# EAGLE design BreakBeamEmitter (EAGLE 6.5.0)
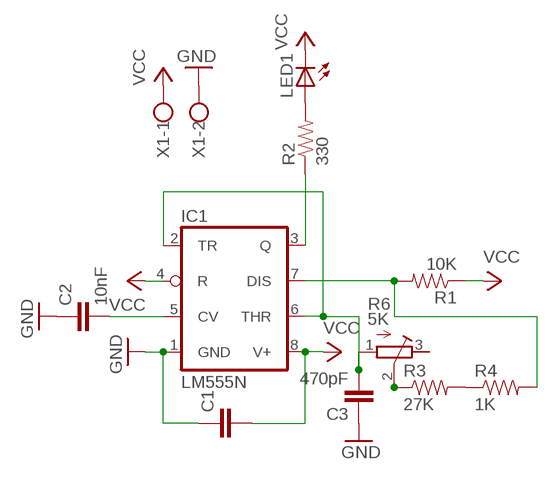
[diagram p0: schematic, sheet 1]

## Parts
C1  CAPPTH1  [CAP-PTH-5MM]
C2  10nF  CAPPTH1  [CAP-PTH-5MM]
C3  470pF  CAPPTH1  [CAP-PTH-5MM]
IC1  LM555N  [DIL08-ROUND]
LED1  LED5MM  [LED5MM]
R1  10K  RESISTORAXIAL-0.3  [AXIAL-0.3]
R2  330  RESISTORAXIAL-0.3  [AXIAL-0.3]
R3  27K  RESISTORAXIAL-0.3  [AXIAL-0.3]
R4  1K  RESISTORAXIAL-0.3  [AXIAL-0.3]
R6  5K  R-TRIMM64Y  [RTRIM64Y]
X1  W237-102  [W237-102]

## Nets
GND: C1.1 C2.1 C3.1 IC1.1(GND) X1.2
N$2: C3.2 IC1.2(TR) IC1.6(THR) R6.1(E)
N$3: R3.P$2 R4.P$1
N$4: R3.P$1 R6.2(S)
N$5: C2.2 IC1.5(CV)
N$6: LED1.A R2.P$2
N$7: IC1.3(Q) R2.P$1
N$8: IC1.7(DIS) R1.P$2 R4.P$2
VCC: C1.2 IC1.4(R) IC1.8(V+) LED1.K(C) R1.P$1 X1.1
Unconnected: R6.3(A)

## Library data of the parts
C1-C3 = SparkFun-Capacitors:CAP: Capacitor Standard 0603 ceramic capacitor, and 0.1" leaded capacitor.
IC1 = adafruit:*555: TIMER Changed DIP package to have round (not oval) pin pads http://www.ladyada.net/library/pcb/eaglelibrary.html
LED1 = adafruit:LED: LED OSRAM: - CHIPLED LG R971, LG N971, LY N971, LG Q971, LY Q971, LO R971, LY R971 LH N974, LH R974 LS Q976, LO Q976, LY Q976 LO Q996 - Hyper CHIPLED LW Q18S LB Q993, LB Q99A, LB R99A - SideLED LS A670, LO A670, LY A670, LG A670, LP A670 LB A673, LV A673, LT A673, LW A673 LH A674 LY A675 LS A676, LA A676, LO A676, LY A676, LW A676 LS A679, LY A679, LG A679 - Hyper Micro SIDELED® LS Y876, LA Y876, LO Y876, LY Y876 LT Y87S - SmartLED LW L88C, LW L88S LB L89C, LB L89S, LG L890 LS L89K, LO L89K, LY L89K LS L896, LA L896, LO L896, LY L896 - TOPLED LS T670, LO T670, LY T670, LG T670, LP T670 LSG T670, LSP T670, LSY T670, LOP T670, LYG T670 LG T671, LOG T671, LSG T671 LB T673, LV T673, LT T673, LW T673 LH T674 LS T676, LA T676, LO T676, LY T676, LB T676, LH T676, LSB T676, LW T676 LB T67C, LV T67C, LT T67C, LS T67K, LO T67K, LY T67K, LW E67C LS E67B, LA E67B, LO E67B, LY E67B, LB E67C, LV E67C, LT E67C LW T67C LS T679, LY T679, LG T679 LS T770, LO T770, LY T770, LG T770, LP T770 LB T773, LV T773, LT T773, LW T773 LH T774 LS E675, LA E675, LY E675, LS T675 LS T776, LA T776, LO T776, LY T776, LB T776 LHGB T686 LT T68C, LB T68C - Hyper Mini TOPLED® LB M676 - Mini TOPLED Santana® LG M470 LS M47K, LO M47K, LY M47K Source: http://www.osram.convergy.de/
R1-R4 = SparkFun-Resistors:RESISTOR: Resistor Basic schematic elements and footprints for 0603, 1206, and PTH resistors.
R6 = resistor:R-TRIMM: Trimm resistor
X1 = con-wago-500:W237-102: WAGO SCREW CLAMP; MPN: 237-102; OC_FARNELL: unknown; OC_NEWARK: 70K9898

## Board
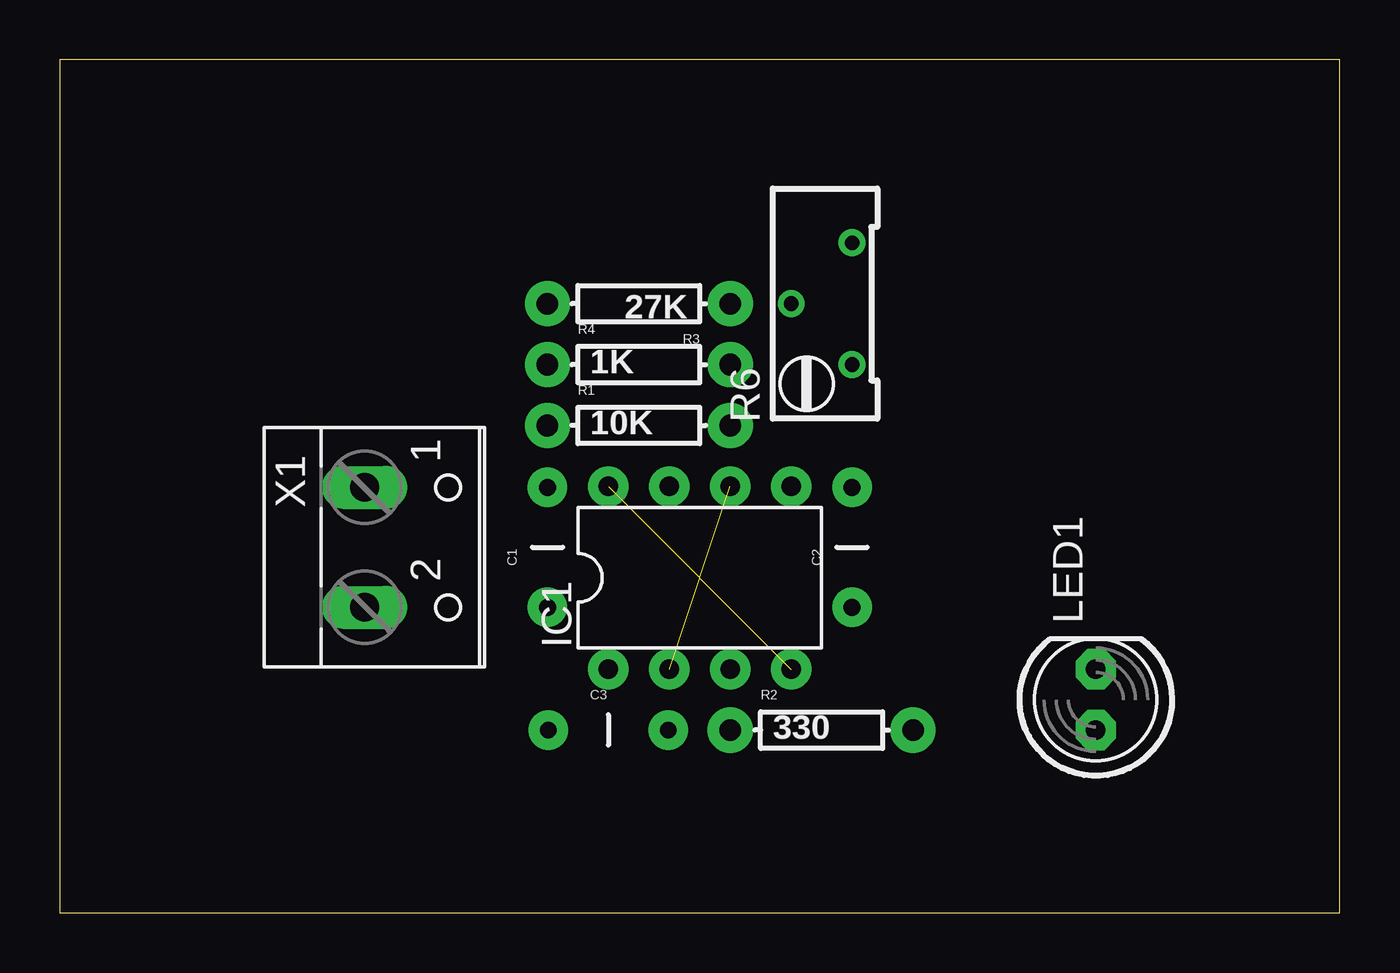
[diagram p1: board, top side]
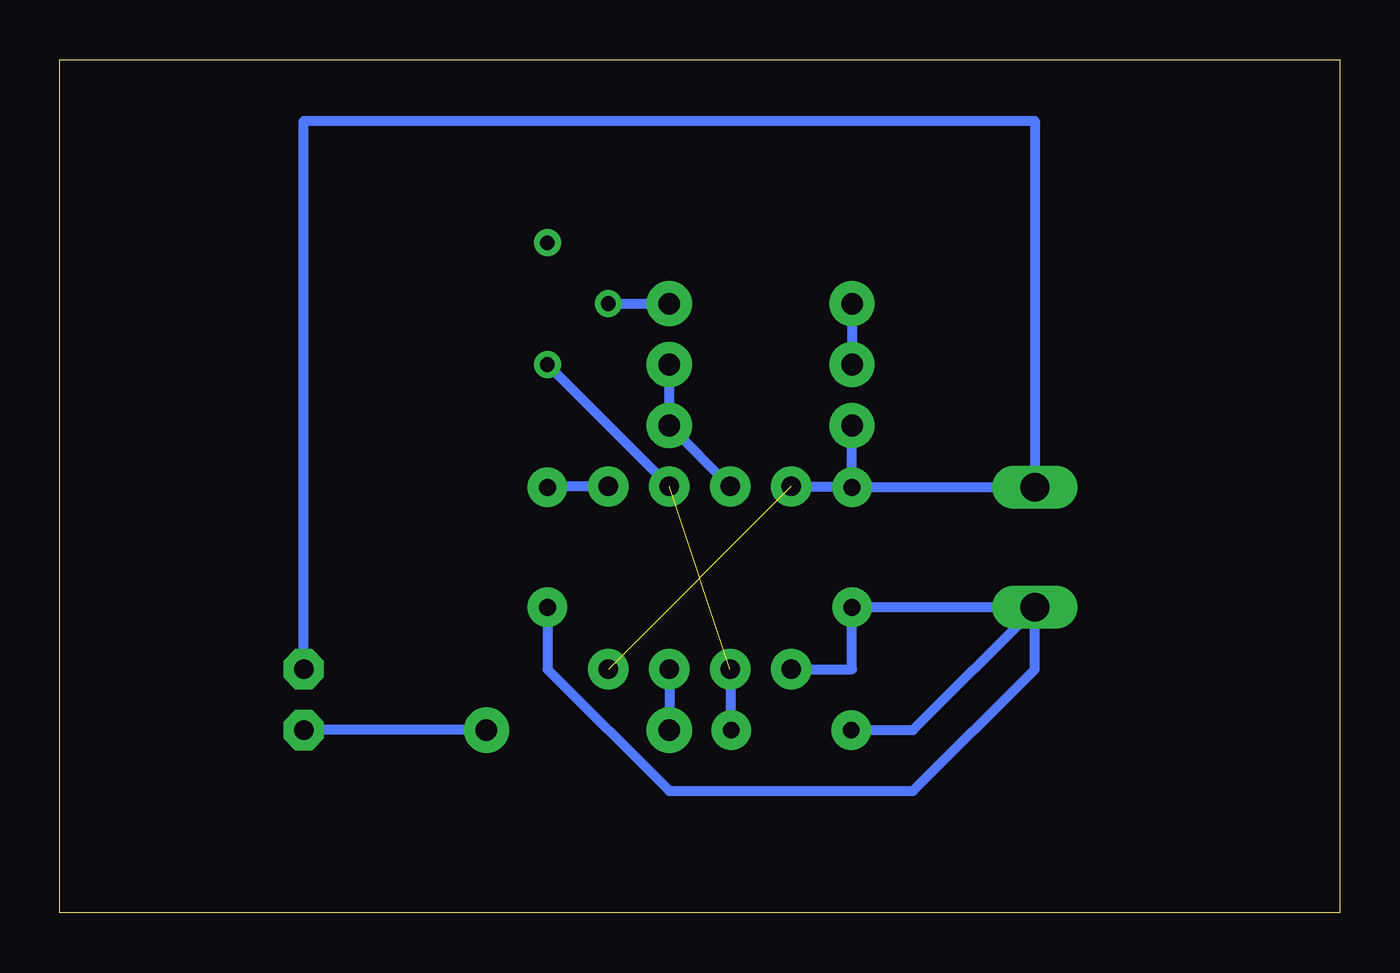
[diagram p2: board, bottom side, seen from below]

Size 53.34 x 35.56 mm. Coordinates in mm from the lower left corner, seen from the top.
Outline: 0,0 53.34,0 53.34,35.56 0,35.56 0,0
Copper layers (1*16): Top 0.035mm / dielectric 1.5mm / Bottom 0.035mm
Design rules "default": minimum track width 10mil, minimum drill 24mil, track to track 8mil, track to pad 8mil, pad to pad 8mil, via to via 8mil, smd to smd 8mil, copper to edge 40mil, drill to drill 8mil, minimum pad ring 10mil, minimum via ring 8mil, stop-mask expansion 4mil, vias tented up to drill 0mil, thermal gap 10mil

### Footprints (pad centres in the part's own frame; a part is rotated, then mirrored left to right if it is on the bottom)
CAP-PTH-5MM = drill 0.7 pad 1.651: 1 -2.5,0; 2 2.5,0
DIL08-ROUND = drill 0.813 pad 1.676: 1 -3.81,-3.81; 2 -1.27,-3.81; 3 1.27,-3.81; 4 3.81,-3.81; 5 3.81,3.81; 6 1.27,3.81; 7 -1.27,3.81; 8 -3.81,3.81
LED5MM = drill 0.813 pad 1.676 octagon: A -1.27,0; K 1.27,0
AXIAL-0.3 = drill 0.9 pad 1.88: P$1 -3.81,0; P$2 3.81,0
RTRIM64Y = drill 0.61: 1 0,-2.54; 2 -2.54,0; 3 0,2.54
W237-102 = drill 1.194 long: 1 -2.5,-1.27; 2 2.5,-1.27

### Placement (x,y rotation side)
C1  20.32,15.24 90 top
C2  33.02,15.24 90 top
C3  22.86,7.62 0 top
IC1  26.67,13.97 0 top
LED1  43.18,8.89 90 top
R1  24.13,20.32 0 top
R2  31.75,7.62 0 top
R3  24.13,25.4 180 top
R4  24.13,22.86 0 top
R6  33.02,25.4 0 top
X1  13.97,15.24 270 top

### Tracks (layer width: path | path; a pad name or v marks a point on that pad's centre or on a via)
GND
  Bottom 0.406: IC1.1 20.32,10.16 C1.1 X1.2 12.7,12.7 | C2.1 33.02,10.16 27.94,5.08 17.78,5.08 12.7,10.16 12.7,12.7 | C3.1 17.78,7.62 12.7,12.7
N$2  (1 unrouted)
  Bottom 0.406: R6.1 IC1.6 | C3.2 25.36,10.12 IC1.2
N$3
  Bottom 0.406: R3.P$2 R4.P$1
N$4
  Bottom 0.406: R6.2 R3.P$1
N$5
  Bottom 0.406: IC1.5 32.98,17.78 C2.2
N$6
  Bottom 0.406: R2.P$2 LED1.A
N$7
  Bottom 0.406: IC1.3 R2.P$1
N$8
  Bottom 0.406: IC1.7 R1.P$2 R4.P$2
VCC  (1 unrouted)
  Bottom 0.406: C1.2 X1.1 12.7,33.02 43.18,33.02 LED1.K | C1.2 R1.P$1 | IC1.8 20.36,17.78 C1.2